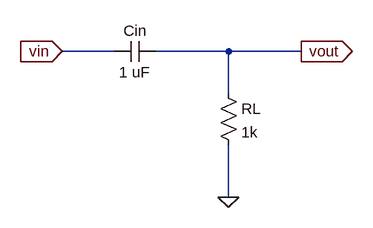
[diagram p0: schematic aula1.6.asc]
aula1.6.asc, the LTspice schematic file:
Version 4
SHEET 1 880 680
WIRE -11008 -3200 -11088 -3200
WIRE -10832 -3200 -10944 -3200
WIRE -10720 -3200 -10832 -3200
WIRE -10832 -3136 -10832 -3200
WIRE -10832 -2976 -10832 -3056
FLAG -10832 -2976 0
FLAG -11088 -3200 vin
IOPIN -11088 -3200 In
FLAG -10720 -3200 vout
IOPIN -10720 -3200 Out
SYMBOL res -10848 -3152 R0
SYMATTR InstName RL
SYMATTR Value 1k
SYMBOL cap -10944 -3216 R90
WINDOW 0 0 32 VBottom 2
WINDOW 3 32 32 VTop 2
SYMATTR InstName Cin
SYMATTR Value 1 uF

The netlist it stands for:
* aula1.6.asc
RL vout 0 1k
Cin vout vin 1 uF
.backanno
.end